# EAGLE design 3tastsp_v4_resistorcooldrive_battcheck (EAGLE 7.5.0)
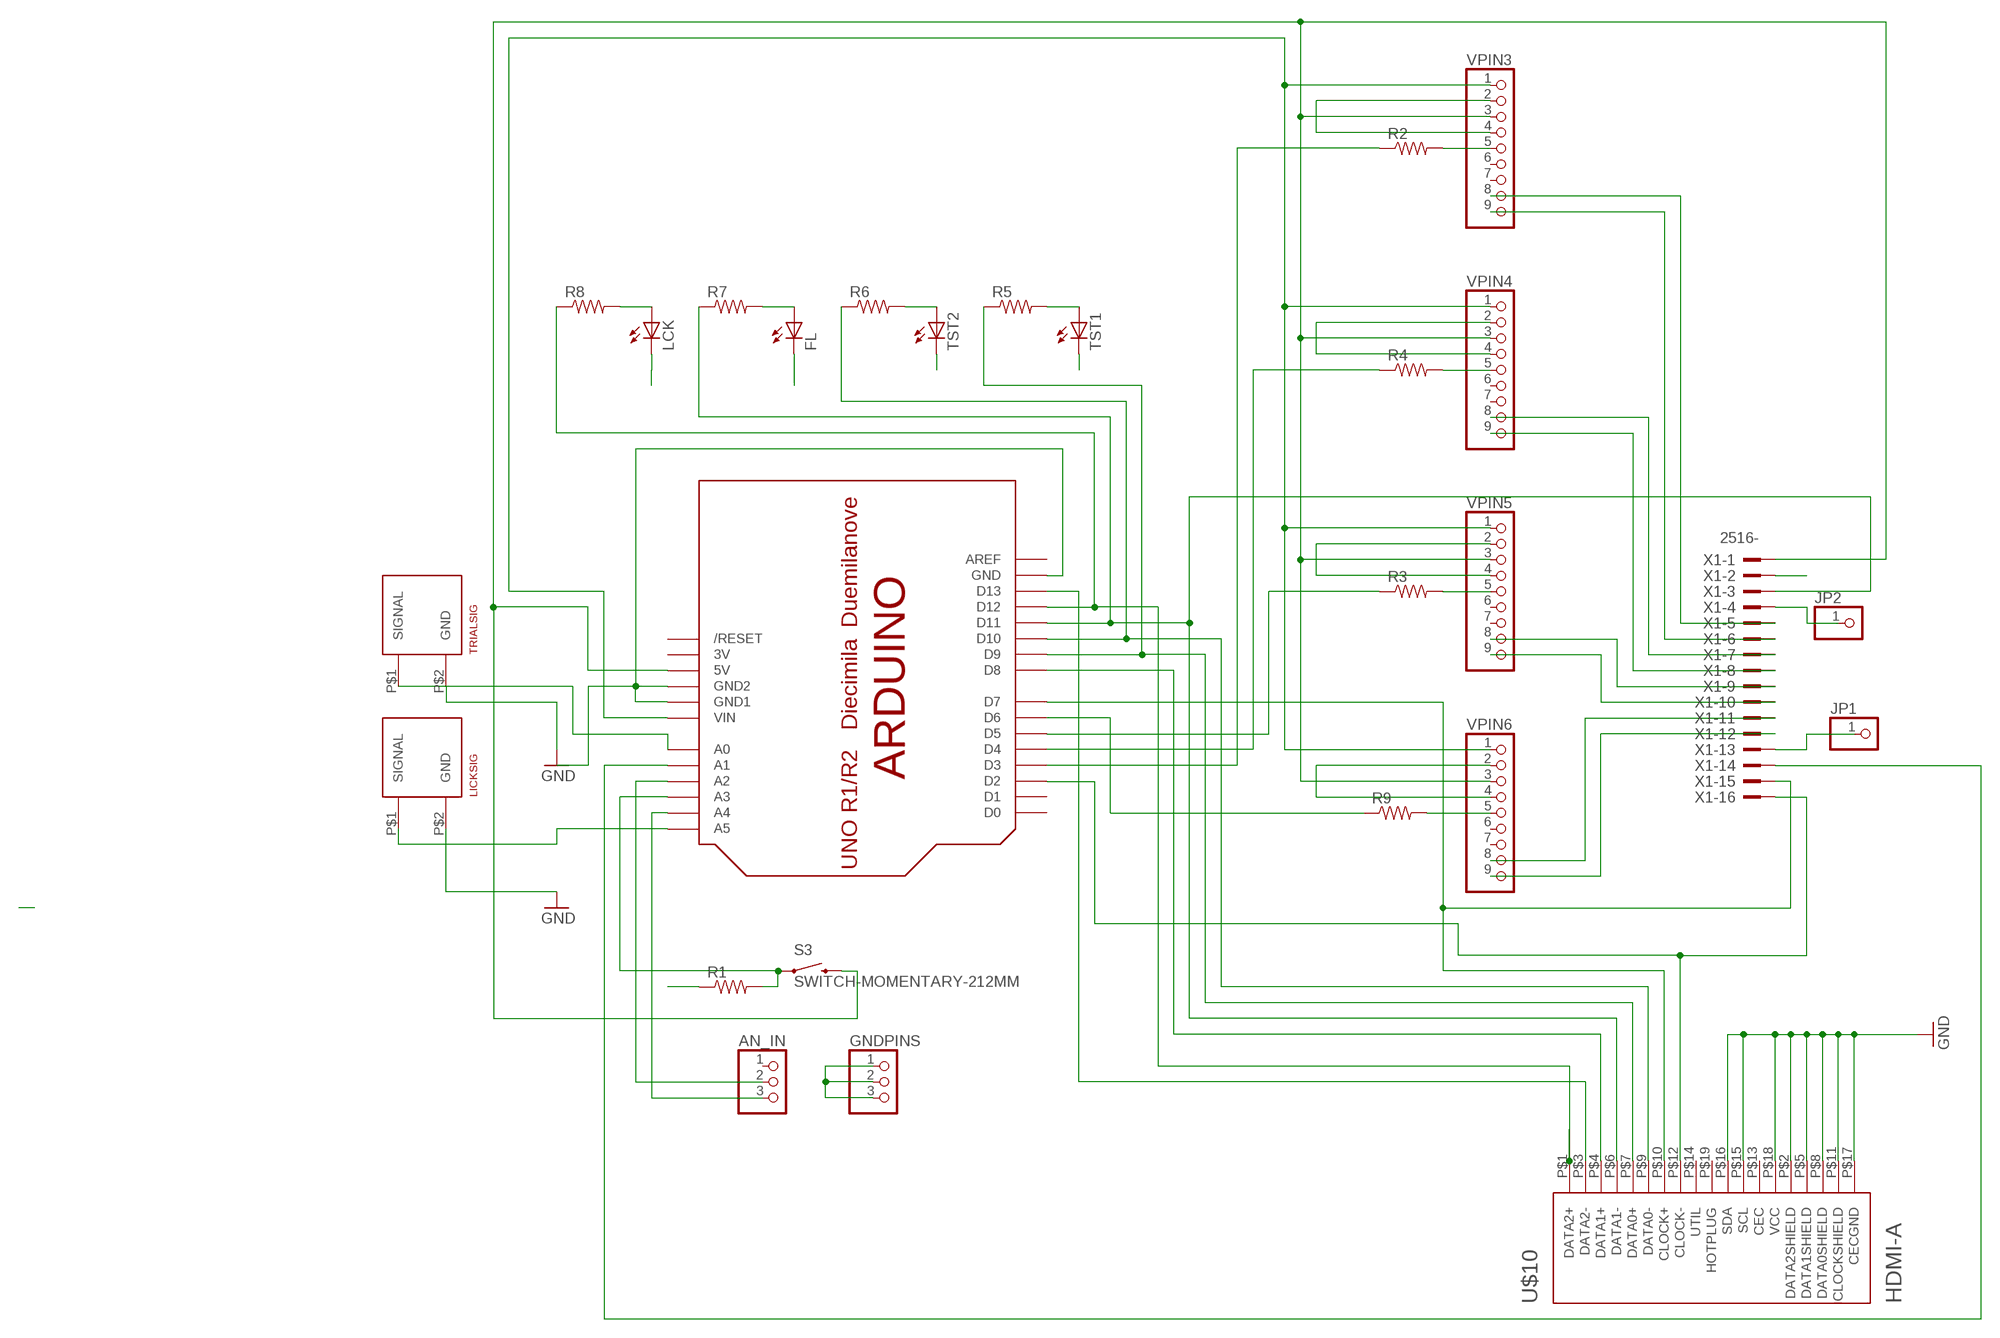
[diagram p0: schematic, sheet 1]

## Parts
AN_IN  PINHD-1X3  [1X03]
FL  LED5MM  [LED5MM]
GNDPINS  PINHD-1X3  [1X03]
JP1  PINHD-1X1  [1X01]
JP2  PINHD-1X1  [1X01]
LCK  LED5MM  [LED5MM]
LICKSIG  BNC_VERTICAL  [BNC_VERTICAL]
R1  RESISTORPTH-1/2W  [AXIAL-0.5]
R2  RESISTORPTH-1/2W  [AXIAL-0.5]
R3  RESISTORPTH-1/2W  [AXIAL-0.5]
R4  RESISTORPTH-1/2W  [AXIAL-0.5]
R5  RESISTORPTH-1/2W  [AXIAL-0.5]
R6  RESISTORPTH-1/2W  [AXIAL-0.5]
R7  RESISTORPTH-1/2W  [AXIAL-0.5]
R8  RESISTORPTH-1/2W  [AXIAL-0.5]
R9  RESISTORPTH-1/2W  [AXIAL-0.5]
S3  SWITCH-MOMENTARY-212MM  [TACTILE-PTH-12MM]
TRIALSIG  BNC_VERTICAL  [BNC_VERTICAL]
TST1  LED5MM  [LED5MM]
TST2  LED5MM  [LED5MM]
U$1  ARDUINO-NOHOLE  [ARDUINO-NOHOLE]
U$10  HDMI-A  [HDMI_A]
VPIN3  PINHD-1X9  [1X09]
VPIN4  PINHD-1X9  [1X09]
VPIN5  PINHD-1X9  [1X09]
VPIN6  PINHD-1X9  [1X09]
X1  2516-  [PAK100/2500-16]

## Nets
D6: U$1.D13 U$10.P$3(DATA2-)
D7: R8.P$1 U$1.D12 U$10.P$1(DATA2+)
D8: U$1.D8 U$10.P$4(DATA1+)
D9: R7.P$1 U$1.D11 U$10.P$6(DATA1-) X1.3
D10: R5.P$1 U$1.D9 U$10.P$7(DATA0+)
D11: R6.P$1 U$1.D10 U$10.P$9(DATA0-)
D12: U$1.D7 U$10.P$10(CLOCK+) X1.15
D13: U$1.D2 U$10.P$12(CLOCK-) X1.16
GND: FL.K(C) GNDPINS.1 GNDPINS.2 GNDPINS.3 LCK.K(C) LICKSIG.P$2(GND) R1.P$1 TRIALSIG.P$2(GND) TST1.K(C) TST2.K(C) U$1.GND U$1.GND1 U$1.GND2 U$10.P$2(DATA2SHIELD) U$10.P$5(DATA1SHIELD) U$10.P$8(DATA0SHIELD) U$10.P$11(CLOCKSHIELD) U$10.P$15(SCL) U$10.P$16(SDA) U$10.P$17(CECGND) U$10.P$18(VCC) VPIN3.2 VPIN3.4 VPIN4.2 VPIN4.4 VPIN5.2 VPIN5.4 VPIN6.2 VPIN6.4 X1.2
N$1: S3.3 U$1.5V VPIN3.3 VPIN4.3 VPIN5.3 VPIN6.3 X1.1
N$2: LICKSIG.P$1(SIGNAL) U$1.A5
N$3: TRIALSIG.P$1(SIGNAL) U$1.A0
N$4: LCK.A R8.P$2
N$5: FL.A R7.P$2
N$7: R6.P$2 TST2.A
N$8: R5.P$2 TST1.A
N$9: R2.P$2 VPIN3.5
N$10: AN_IN.3 U$1.A4
N$11: AN_IN.2 U$1.A2
N$12: R4.P$2 VPIN4.5
N$13: R9.P$1 U$1.D6
N$14: R3.P$1 U$1.D5
N$15: R4.P$1 U$1.D4
N$16: R2.P$1 U$1.D3
N$17: JP2.1 X1.4
N$18: R1.P$2 S3.1 U$1.A3
N$19: U$1.VIN VPIN3.1 VPIN4.1 VPIN5.1 VPIN6.1
N$20: VPIN3.8 X1.5
N$21: VPIN3.9 X1.6
N$22: VPIN4.8 X1.7
N$23: VPIN4.9 X1.8
N$24: VPIN5.9 X1.10
N$25: VPIN5.8 X1.9
N$26: VPIN6.8 X1.11
N$27: VPIN6.9 X1.12
N$28: R3.P$2 VPIN5.5
N$29: R9.P$2 VPIN6.5
N$30: U$1.A1 X1.14
N$31: JP1.1 X1.13
Unconnected: AN_IN.1 U$1.AREF U$1.D0 U$1.D1 U$1.RESET(/RESET) U$10.P$13(CEC) U$10.P$14(UTIL) U$10.P$19(HOTPLUG) VPIN3.6 VPIN3.7 VPIN4.6 VPIN4.7 VPIN5.6 VPIN5.7 VPIN6.6 VPIN6.7

## Power pins joined to a net without a drawn wire
3V: U$1.3V

## Library data of the parts
AN_IN GNDPINS = pinhead:PINHD-1X3: PIN HEADER
FL LCK TST1 TST2 = led:LED: LED OSRAM: - CHIPLED LG R971, LG N971, LY N971, LG Q971, LY Q971, LO R971, LY R971 LH N974, LH R974 LS Q976, LO Q976, LY Q976 LO Q996 - Hyper CHIPLED LW Q18S LB Q993, LB Q99A, LB R99A - SideLED LS A670, LO A670, LY A670, LG A670, LP A670 LB A673, LV A673, LT A673, LW A673 LH A674 LY A675 LS A676, LA A676, LO A676, LY A676, LW A676 LS A679, LY A679, LG A679 - Hyper Micro SIDELED® LS Y876, LA Y876, LO Y876, LY Y876 LT Y87S - SmartLED LW L88C, LW L88S LB L89C, LB L89S, LG L890 LS L89K, LO L89K, LY L89K LS L896, LA L896, LO L896, LY L896 - TOPLED LS T670, LO T670, LY T670, LG T670, LP T670 LSG T670, LSP T670, LSY T670, LOP T670, LYG T670 LG T671, LOG T671, LSG T671 LB T673, LV T673, LT T673, LW T673 LH T674 LS T676, LA T676, LO T676, LY T676, LB T676, LH T676, LSB T676, LW T676 LB T67C, LV T67C, LT T67C, LS T67K, LO T67K, LY T67K, LW E67C LS E67B, LA E67B, LO E67B, LY E67B, LB E67C, LV E67C, LT E67C LW T67C LS T679, LY T679, LG T679 LS T770, LO T770, LY T770, LG T770, LP T770 LB T773, LV T773, LT T773, LW T773 LH T774 LS E675, LA E675, LY E675, LS T675 LS T776, LA T776, LO T776, LY T776, LB T776 LHGB T686 LT T68C, LB T68C - Hyper Mini TOPLED® LB M676 - Mini TOPLED Santana® LG M470 LS M47K, LO M47K, LY M47K Source: http://www.osram.convergy.de LUXEON: - LUMILED® LXK2-PW12-R00, LXK2-PW12-S00, LXK2-PW14-U00, LXK2-PW14-V00 LXK2-PM12-R00, LXK2-PM12-S00, LXK2-PM14-U00 LXK2-PE12-Q00, LXK2-PE12-R00, LXK2-PE12-S00, LXK2-PE14-T00, LXK2-PE14-U00 LXK2-PB12-K00, LXK2-PB12-L00, LXK2-PB12-M00, LXK2-PB14-N00, LXK2-PB14-P00, LXK2-PB14-Q00 LXK2-PR12-L00, LXK2-PR12-M00, LXK2-PR14-Q00, LXK2-PR14-R00 LXK2-PD12-Q00, LXK2-PD12-R00, LXK2-PD12-S00 LXK2-PH12-R00, LXK2-PH12-S00 LXK2-PL12-P00, LXK2-PL12-Q00, LXK2-PL12-R00 Source: www.luxeon.com KINGBRIGHT: KA-3528ASYC Source: www.kingbright.com
JP1 JP2 = pinhead:PINHD-1X1: PIN HEADER
LICKSIG TRIALSIG = open-ephys:BNC_VERTICAL: BNC plug, through-hole, vertical
R1-R9 = SparkFun-Resistors:RESISTOR: Resistor Basic schematic elements and footprints for 0603, 1206, and PTH resistors.
S3 = SparkFun-Electromechanical:SWITCH-MOMENTARY-2: Various NO switches- pushbuttons, reed, etc; PROD_ID: SWCH-09185
U$1 = ARDUINO_nohole:ARDUINO: Arduino Diecimila/Duemilanove Make a shield with ease, this package has all the named pins as well as the two mounting drill holes and an outline of the USB and DC power connector. The outline is on the DIMENSION layer, so if your board house uses it they will cut the outline to match. http://www.ladyada.net/library/pcb/eaglelibrary.html
U$10 = connectors:HDMI-A: Horizonal HDMI type "A" jack
VPIN3-VPIN6 = pinhead:PINHD-1X9: PIN HEADER
X1 = con-3m:2516-: 3M (TM) Pak 100 4-Wall Header Source: 3M; OC_FARNELL: unknown; OC_NEWARK: unknown

## Board
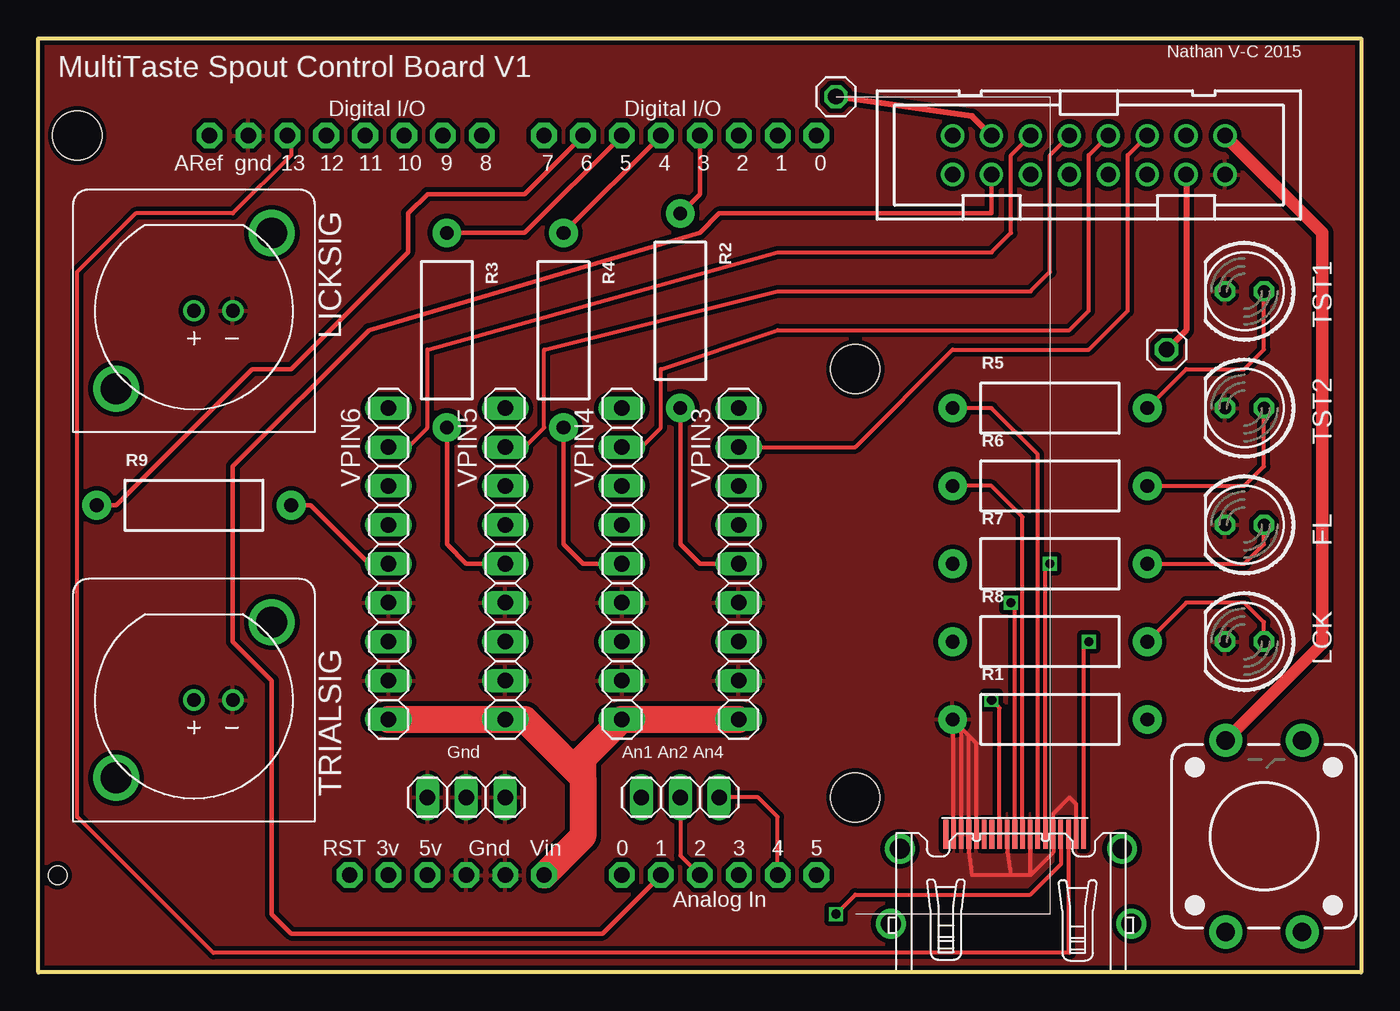
[diagram p1: board, top side]
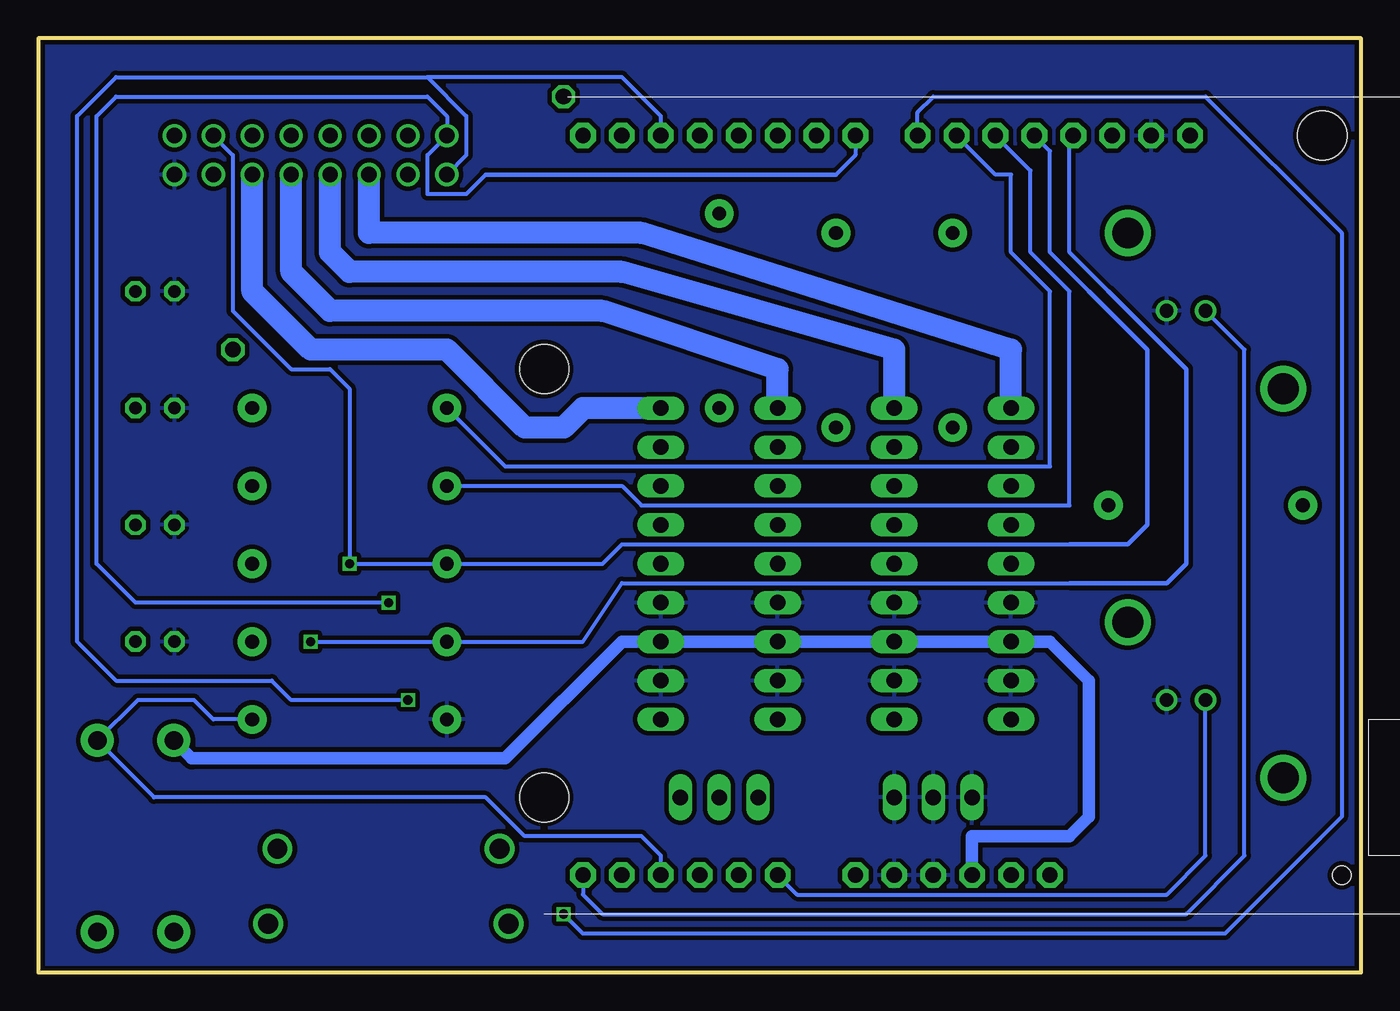
[diagram p2: board, bottom side, seen from below]

Size 86.36 x 60.96 mm. Coordinates in mm from the lower left corner, seen from the top.
Outline: 0,0 0,60.96 86.36,60.96 86.36,0 0,0
Copper layers (1*16): Top 0.035mm / dielectric 1.5mm / Bottom 0.035mm
Design rules "SeeedStudio_2layer_DRU_no_angle_20140221": minimum track width 6mil, minimum drill 12mil, track to track 6mil, track to pad 6mil, pad to pad 6mil, via to via 6mil, smd to smd 0mil, copper to edge 10mil, drill to drill 10mil, minimum pad ring 10mil, minimum via ring 6mil, stop-mask expansion 2mil, vias tented up to drill 100mil, thermal gap 10mil
Holes 3.2 mm at 2.54,54.61 53.34,39.37 53.34,11.43
Holes 1.2 mm at 1.27,6.35

### Footprints (pad centres in the part's own frame; a part is rotated, then mirrored left to right if it is on the bottom)
1X03 = drill 1.016 long: 1 -2.54,0; 2 0,0; 3 2.54,0
LED5MM = drill 0.813 octagon: A -1.27,0; K 1.27,0
1X01 = drill 1.016 octagon: 1 0,0
BNC_VERTICAL = drill 0.89: P$1 0,0; P$2 2.54,0 | drill 2.01: P$3 5.08,5.08; P$4 -5.08,-5.08
AXIAL-0.5 = drill 0.9 pad 1.88: P$1 -6.35,0; P$2 6.35,0
TACTILE-PTH-12MM = drill 1.2 pad 2.159: 1 6.25,-2.5; 2 -6.25,-2.5; 3 6.25,2.5; 4 -6.25,2.5
ARDUINO-NOHOLE = drill 1 pad 1.676 octagon: 3V 35.56,2.54; 5V 38.1,2.54; A0 50.8,2.54; A1 53.34,2.54; A2 55.88,2.54; A3 58.42,2.54; A4 60.96,2.54; A5 63.5,2.54; AREF 23.876,50.8; D0 63.5,50.8; D1 60.96,50.8; D2 58.42,50.8; D3 55.88,50.8; D4 53.34,50.8; D5 50.8,50.8; D6 48.26,50.8; D7 45.72,50.8; D8 41.656,50.8; D9 39.116,50.8; D10 36.576,50.8; D11 34.036,50.8; D12 31.496,50.8; D13 28.956,50.8; GND 26.416,50.8; GND1 43.18,2.54; GND2 40.64,2.54; RESET 33.02,2.54; VIN 45.72,2.54
HDMI_A = smd 0.3 x 1.9: P$1 4.75,3.95; P$2 4.25,3.95; P$3 3.75,3.95; P$4 3.25,3.95; P$5 2.75,3.95; P$6 2.25,3.95; P$7 1.75,3.95; P$8 1.25,3.95; P$9 0.75,3.95; P$10 0.25,3.95; P$11 -0.25,3.95; P$12 -0.75,3.95; P$13 -1.25,3.95; P$14 -1.75,3.95; P$15 -2.25,3.95; P$16 -2.75,3.95; P$17 -3.25,3.95; P$18 -3.75,3.95; P$19 -4.25,3.95 | drill 1.3: P$20 -7.25,3; P$21 7.25,3; P$22 7.85,-1.9; P$23 -7.85,-1.9
1X09 = drill 1.016 long: 1 -10.16,0; 2 -7.62,0; 3 -5.08,0; 4 -2.54,0; 5 0,0; 6 2.54,0; 7 5.08,0; 8 7.62,0; 9 10.16,0
PAK100/2500-16 = drill 1 pad 1.422: 1 -8.89,-1.27; 2 -8.89,1.27; 3 -6.35,-1.27; 4 -6.35,1.27; 5 -3.81,-1.27; 6 -3.81,1.27; 7 -1.27,-1.27; 8 -1.27,1.27; 9 1.27,-1.27; 10 1.27,1.27; 11 3.81,-1.27; 12 3.81,1.27; 13 6.35,-1.27; 14 6.35,1.27; 15 8.89,-1.27; 16 8.89,1.27

### Placement (x,y rotation side)
AN_IN  41.91,11.43 0 top
FL  78.74,29.21 180 top
GNDPINS  27.94,11.43 0 top
JP1  52.07,57.15 0 top
JP2  73.66,40.64 0 top
LCK  78.74,21.59 180 top
LICKSIG  10.16,43.18 0 top
R1  66.04,16.51 0 top
R2  41.91,43.18 270 top
R3  26.67,41.91 270 top
R4  34.29,41.91 270 top
R5  66.04,36.83 0 top
R6  66.04,31.75 0 top
R7  66.04,26.67 0 top
R8  66.04,21.59 0 top
R9  10.16,30.48 0 top
S3  80.01,8.89 90 top
TRIALSIG  10.16,17.78 0 top
TST1  78.74,44.45 180 top
TST2  78.74,36.83 180 top
U$1  -12.7,3.81 0 top
U$10  63.5,5.08 0 top
VPIN3  45.72,26.67 90 top
VPIN4  38.1,26.67 90 top
VPIN5  30.48,26.67 90 top
VPIN6  22.86,26.67 90 top
X1  68.58,53.34 180 top

### Tracks (layer width: path | path; a pad name or v marks a point on that pad's centre or on a via)
D6
  Top 0.254: U$10.P$3 67.25,1.33 67.31,1.27 11.43,1.27 2.54,10.16 2.54,45.72 6.35,49.53 12.7,49.53 16.51,53.34 16.51,54.36 U$1.D13
D7  (via drill 0.6)
  Top 0.254: U$10.P$1 68.25,21.26 v68.58,21.59
  Bottom 0.254: 19.05,25.4 48.26,25.4 50.8,21.59 R8.P$1 v68.58,21.59 | 16.51,44.45 19.05,46.99 19.05,54.36 U$1.D12
  Bottom 0.305: 19.05,25.4 12.7,25.4 11.43,26.67 11.43,39.37 16.51,44.45
D8  (via drill 0.6)
  Top 0.254: v52.07,3.81 53.34,5.08 64.77,5.08 66.75,7.06 U$10.P$4
  Bottom 0.254: U$1.D8 28.96,56.13 27.94,57.15 10.16,57.15 1.27,48.26 1.27,10.16 8.89,2.54 50.8,2.54 v52.07,3.81
D9  (via drill 0.6)
  Top 0.254: U$10.P$6 65.75,26.38 v66.04,26.67
  Bottom 0.254: 19.05,27.94 48.26,27.94 49.53,26.67 R7.P$1 v66.04,26.67 66.04,38.1 67.31,39.37 69.85,39.37 73.66,43.18 73.66,53.34 X1.3 | 17.78,44.45 20.32,46.99 20.32,53.59 U$1.D11
  Bottom 0.305: 19.05,27.94 15.24,27.94 13.97,29.21 13.97,40.64 17.78,44.45
D10
  Top 0.254: U$10.P$7 65.25,33.81 62.23,36.83 R5.P$1
  Bottom 0.254: R5.P$1 55.88,33.02 20.32,33.02 20.32,44.45 22.86,46.99 22.86,52.07 23.88,52.07 U$1.D9
D11
  Top 0.254: U$10.P$9 64.25,29.73 62.23,31.75 R6.P$1
  Bottom 0.254: R6.P$1 48.26,31.75 46.99,30.48 19.05,30.48 19.05,44.45 21.59,46.99 21.59,52.32 U$1.D10
D12  (via drill 0.6)
  Top 0.254: U$10.P$10 63.75,23.88 v63.5,24.13
  Bottom 0.254: v63.5,24.13 80.01,24.13 82.55,26.67 82.55,55.88 81.28,57.15 60.96,57.15 59.69,55.88 X1.15 60.96,53.34 60.96,50.8 58.42,50.8 57.15,52.07 | U$1.D7 33.02,53.34 34.29,52.07
  Bottom 0.305: 57.15,52.07 34.29,52.07
D13  (via drill 0.6)
  Top 0.254: U$10.P$12 62.75,17.26 v62.23,17.78
  Bottom 0.254: v62.23,17.78 69.85,17.78 71.12,19.05 81.28,19.05 83.82,21.59 83.82,55.88 81.28,58.42 60.96,58.42 | 60.96,58.42 58.42,55.88 58.42,53.34 X1.16 | U$1.D2 45.72,55.88 48.26,58.42 60.96,58.42
GND
  Top 0.254: U$10.P$18 59.75,16.45 | U$10.P$17 60.25,15.95 | 60.25,15.95 59.75,16.45 | 60.75,15.45 U$10.P$16 60.75,7.83 60.96,6.35 63.5,6.35 | 60.75,15.45 60.25,15.95 | 59.75,16.45 R1.P$1 | U$10.P$15 61.25,14.95 60.75,15.45 | 64.77,6.35 66.25,7.83 U$10.P$5 66.25,10.37 67.31,11.43 67.75,10.99 U$10.P$2 | 64.77,6.35 64.77,9.01 U$10.P$8 64.75,7.64 64.77,6.35 | 64.77,6.35 63.5,6.35 | U$10.P$11 63.25,7.87 63.5,6.35
  pour Bottom (isolate 0.305): 0,60.96 0,0 86.36,0 86.36,3.81 86.36,60.96
  pour Top (isolate 0.305): 0,60.96 0,0 86.36,0 86.36,5.08 86.36,60.96
N$1
  Top 0.813: X1.1 83.82,48.26 83.82,21.45 S3.3
  Bottom 0.813: U$1.5V 25.4,8.89 19.05,8.89 17.78,10.16 17.78,19.05 20.32,21.59 VPIN6.3 VPIN5.3 VPIN4.3 VPIN3.3 48.26,21.59 55.88,13.97 76.34,13.97 S3.3
N$2
  Bottom 0.254: U$1.A5 50.8,5.08 49.53,3.81 11.43,3.81 7.62,7.62 7.62,40.64 LICKSIG.P$1
N$3
  Bottom 0.254: U$1.A0 36.83,5.08 12.7,5.08 10.16,7.62 TRIALSIG.P$1
N$4
  Top 0.254: LCK.A 80.01,22.86 78.74,24.13 74.93,24.13 R8.P$2
N$5
  Top 0.254: R7.P$2 78.74,26.67 80.01,27.94 FL.A
N$7
  Top 0.254: R6.P$2 78.74,31.75 80.01,33.02 TST2.A
N$8
  Top 0.254: R5.P$2 74.93,39.37 78.74,39.37 80.01,40.64 TST1.A
N$9
  Top 0.305: R2.P$2 41.91,27.94 43.18,26.67 VPIN3.5
N$10
  Top 0.254: U$1.A4 48.26,10.16 46.99,11.43 AN_IN.3
N$11
  Top 0.254: AN_IN.2 41.91,7.62 U$1.A2
N$12
  Top 0.305: R4.P$2 34.29,27.94 35.56,26.67 VPIN4.5
N$13
  Top 0.305: U$1.D6 31.75,50.8 25.4,50.8 24.13,49.53 24.13,46.99 16.51,39.37 13.97,39.37 5.08,30.48 R9.P$1
N$14
  Top 0.305: U$1.D5 31.75,48.26 R3.P$1
N$15
  Top 0.305: U$1.D4 R4.P$1
N$16
  Top 0.305: U$1.D3 43.18,50.8 R2.P$1
N$17
  Top 0.406: X1.4 74.93,41.91 JP2.1
N$18
  Bottom 0.254: U$1.A3 45.72,7.62 46.99,8.89 54.61,8.89 57.15,11.43 78.8,11.43 S3.1 79.87,17.78 76.2,17.78 74.93,16.51 R1.P$2
N$19
  Top 1.778: 35.56,12.7 31.75,16.51 VPIN5.1 VPIN6.1 | 35.56,12.7 35.56,8.89 U$1.VIN | 35.56,12.7 35.56,13.97 VPIN4.1 VPIN3.1
N$20
  Top 0.254: VPIN3.8 53.34,34.29 59.69,40.64 68.58,40.64 71.12,43.18 71.12,53.34 X1.5
N$21
  Bottom 1.422: VPIN3.9 50.8,36.83 52.07,35.56 54.61,35.56 59.69,40.64 68.58,40.64 72.39,44.45 X1.6
N$22
  Top 0.254: VPIN4.8 39.37,34.29 40.64,35.56 40.64,39.37 48.26,41.91 67.31,41.91 68.58,43.18 68.58,53.34 X1.7
N$23
  Bottom 1.422: VPIN4.9 38.1,39.37 49.53,43.18 67.31,43.18 69.85,45.72 X1.8
N$24
  Bottom 1.422: VPIN5.9 30.48,40.64 48.26,45.72 66.04,45.72 67.31,46.99 X1.10
N$25
  Top 0.254: VPIN5.8 31.75,34.29 33.02,35.56 33.02,40.64 48.26,44.45 64.77,44.45 66.04,45.72 66.04,53.34 X1.9
N$26
  Top 0.254: VPIN6.8 24.13,34.29 25.4,35.56 25.4,40.64 48.26,46.99 62.23,46.99 63.5,48.26 63.5,53.34 X1.11
N$27
  Bottom 1.422: VPIN6.9 22.86,40.64 46.99,48.26 64.77,48.26 X1.12
N$28
  Top 0.305: R3.P$2 26.67,27.94 27.94,26.67 VPIN5.5
N$29
  Top 0.305: R9.P$2 17.78,30.48 21.59,26.67 VPIN6.5
N$30
  Top 0.305: X1.14 62.23,49.53 44.45,49.53 43.18,48.26 21.59,41.91 12.7,33.02 12.7,21.59 15.24,19.05 15.24,3.81 16.51,2.54 36.83,2.54 U$1.A1
N$31
  Top 0.406: X1.13 60.96,55.88 JP1.1

### Text on the board
tPlace: Nathan V-C 2015 | MultiTaste Spout Control Board V1 | Gnd | An1 An2 An4